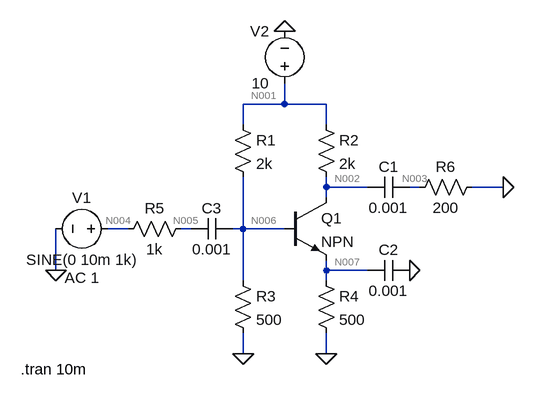
[diagram p0: schematic EC.asc]
EC.asc, the LTspice schematic file:
Version 4
SHEET 1 880 680
WIRE 176 -80 176 -112
WIRE 176 -80 112 -80
WIRE 240 -80 176 -80
WIRE 112 -48 112 -80
WIRE 240 -48 240 -80
WIRE 240 48 240 32
WIRE 304 48 240 48
WIRE 384 48 368 48
WIRE 512 48 464 48
WIRE 240 64 240 48
WIRE -64 112 -96 112
WIRE 32 112 16 112
WIRE 112 112 112 32
WIRE 112 112 96 112
WIRE 176 112 112 112
WIRE -176 176 -176 112
WIRE 240 176 240 160
WIRE 304 176 240 176
WIRE 112 192 112 112
WIRE 240 192 240 176
WIRE 112 304 112 272
WIRE 240 304 240 272
FLAG 112 304 0
FLAG 240 304 0
FLAG -176 176 0
FLAG 512 48 0
FLAG 368 176 0
FLAG 176 -192 0
SYMBOL res 96 -64 R0
SYMATTR InstName R1
SYMATTR Value 2k
SYMBOL res 224 -64 R0
SYMATTR InstName R2
SYMATTR Value 2k
SYMBOL res 96 176 R0
SYMATTR InstName R3
SYMATTR Value 500
SYMBOL res 224 176 R0
SYMATTR InstName R4
SYMATTR Value 500
SYMBOL npn 176 64 R0
SYMATTR InstName Q1
SYMBOL cap 368 32 R90
WINDOW 0 0 32 VBottom 2
WINDOW 3 32 32 VTop 2
SYMATTR InstName C1
SYMATTR Value 0.001
SYMBOL cap 368 160 R90
WINDOW 0 0 32 VBottom 2
WINDOW 3 32 32 VTop 2
SYMATTR InstName C2
SYMATTR Value 0.001
SYMBOL cap 96 96 R90
WINDOW 0 0 32 VBottom 2
WINDOW 3 32 32 VTop 2
SYMATTR InstName C3
SYMATTR Value 0.001
SYMBOL voltage -80 112 R90
WINDOW 0 -32 56 VBottom 2
WINDOW 3 32 56 VTop 2
WINDOW 123 60 56 VTop 2
WINDOW 39 0 0 Left 0
SYMATTR InstName V1
SYMATTR Value SINE(0 10m 1k)
SYMATTR Value2 AC 1
SYMBOL res 32 96 R90
WINDOW 0 0 56 VBottom 2
WINDOW 3 32 56 VTop 2
SYMATTR InstName R5
SYMATTR Value 1k
SYMBOL res 480 32 R90
WINDOW 0 0 56 VBottom 2
WINDOW 3 32 56 VTop 2
SYMATTR InstName R6
SYMATTR Value 200
SYMBOL voltage 176 -96 R180
WINDOW 0 24 96 Left 2
WINDOW 3 24 16 Left 2
WINDOW 123 0 0 Left 0
WINDOW 39 0 0 Left 0
SYMATTR InstName V2
SYMATTR Value 10
TEXT -230 328 Left 2 !.tran 10m

The netlist it stands for:
* EC.asc
R1 N001 N006 2k
R2 N001 N002 2k
R3 N006 0 500
R4 N007 0 500
Q1 N002 N006 N007 0 NPN
C1 N003 N002 0.001
C2 0 N007 0.001
C3 N006 N005 0.001
V1 N004 0 SINE(0 10m 1k) AC 1
R5 N005 N004 1k
R6 0 N003 200
V2 N001 0 10
.model NPN NPN
.model PNP PNP
.lib standard.bjt
.tran 10m
.backanno
.end

* Results of the author's LTspice run, read from the files saved beside the schematic
* Operating Point, zero values left out:
*   V(n001) = 10 V
*   V(n006) = 1.991 V
*   V(n002) = 5.271 V
*   V(n007) = 1.194 V
*   Ic(Q1) = 2.364 mA
*   Ib(Q1) = 23.64 µA
*   Ie(Q1) = -2.388 mA
*   I(R4) = 2.388 mA
*   I(R3) = 3.981 mA
*   I(R2) = 2.364 mA
*   I(R1) = 4.005 mA
*   I(V2) = -6.369 mA
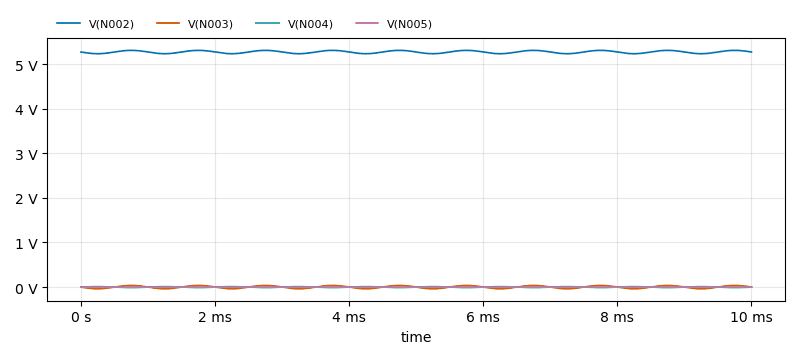
[diagram p1: Transient Analysis of EC.asc, plotted from the saved traces]
* Transient Analysis, 1 run:
*   V(N002): min 5.233 V, max 5.308 V, average 5.271 V, rms 5.271 V, last 5.271 V
*   V(N003): min -38.45 mV, max 36.83 mV, average -152.2 µV, rms 26.59 mV, last 101.3 µV
*   V(N004): min -10 mV, max 9.997 mV, average -55.93 nV, rms 7.071 mV, last 0 V
*   V(N005): min -2.276 mV, max 2.251 mV, average -1.571 µV, rms 1.601 mV, last 1.592 µV